# EAGLE design stepper_w_2_input_bitsA (EAGLE 6.4)
stepper conroller with 2 counting bits for unipolar stepper motor
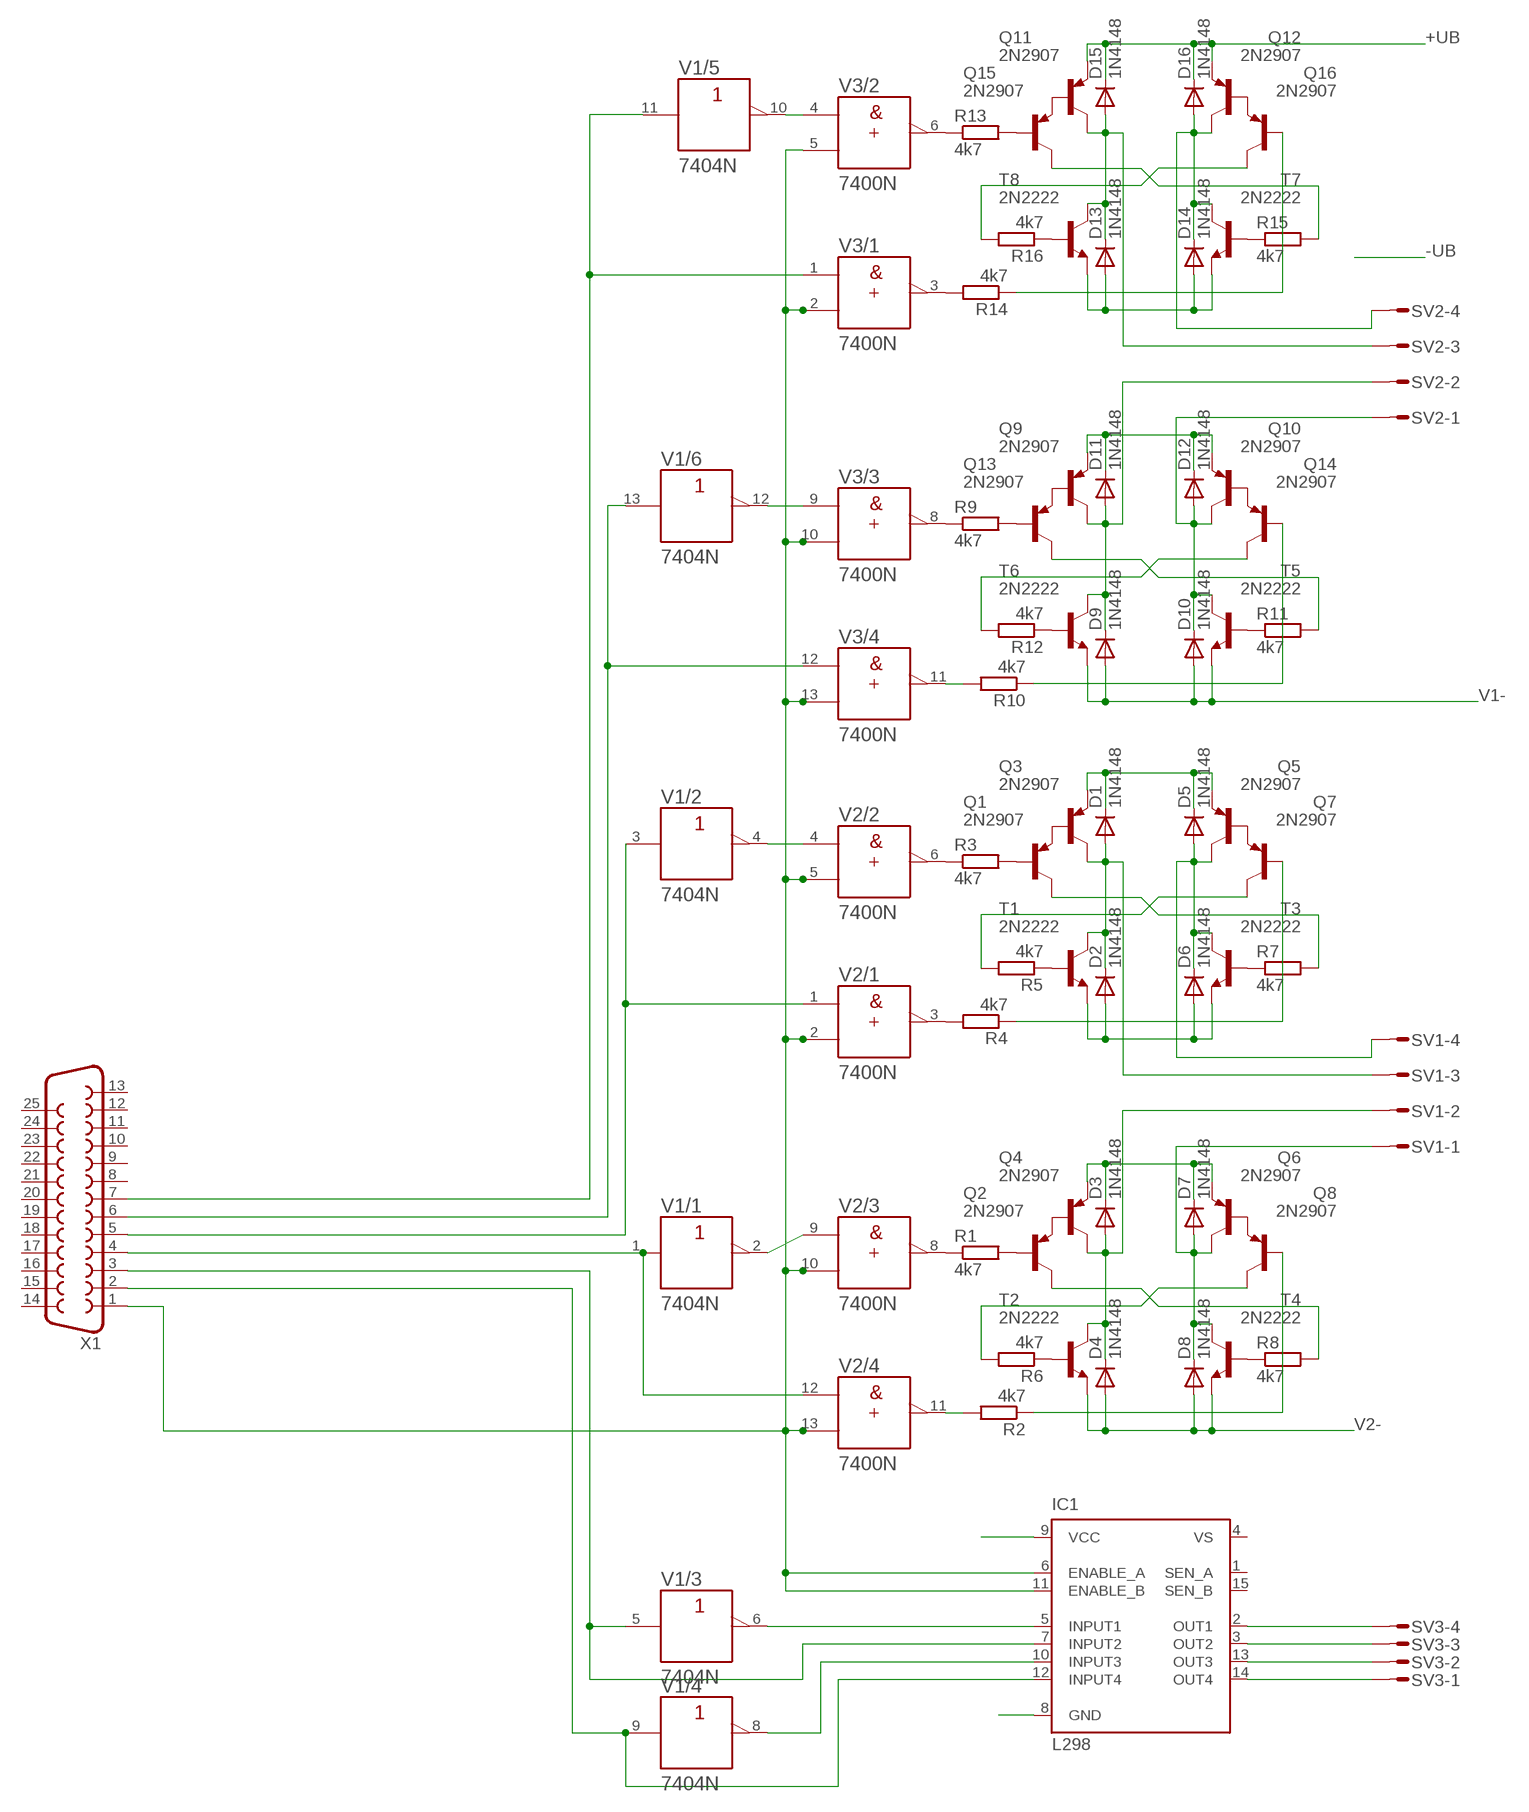
[diagram p0: schematic, sheet 1]

## Parts
D1  1N4148  DIODE-D-2.5  [D-2.5]
D2  1N4148  DIODE-D-2.5  [D-2.5]
D3  1N4148  DIODE-D-2.5  [D-2.5]
D4  1N4148  DIODE-D-2.5  [D-2.5]
D5  1N4148  DIODE-D-2.5  [D-2.5]
D6  1N4148  DIODE-D-2.5  [D-2.5]
D7  1N4148  DIODE-D-2.5  [D-2.5]
D8  1N4148  DIODE-D-2.5  [D-2.5]
D9  1N4148  DIODE-D-2.5  [D-2.5]
D10  1N4148  DIODE-D-2.5  [D-2.5]
D11  1N4148  DIODE-D-2.5  [D-2.5]
D12  1N4148  DIODE-D-2.5  [D-2.5]
D13  1N4148  DIODE-D-2.5  [D-2.5]
D14  1N4148  DIODE-D-2.5  [D-2.5]
D15  1N4148  DIODE-D-2.5  [D-2.5]
D16  1N4148  DIODE-D-2.5  [D-2.5]
IC1  L298  [MULTIWATT-15]
Q1  2N2907  [TO18]
Q2  2N2907  [TO18]
Q3  2N2907  [TO18]
Q4  2N2907  [TO18]
Q5  2N2907  [TO18]
Q6  2N2907  [TO18]
Q7  2N2907  [TO18]
Q8  2N2907  [TO18]
Q9  2N2907  [TO18]
Q10  2N2907  [TO18]
Q11  2N2907  [TO18]
Q12  2N2907  [TO18]
Q13  2N2907  [TO18]
Q14  2N2907  [TO18]
Q15  2N2907  [TO18]
Q16  2N2907  [TO18]
R1  4k7  R-EU_0204/7  [0204/7]
R2  4k7  R-EU_0207/10  [0207/10]
R3  4k7  R-EU_0207/10  [0207/10]
R4  4k7  R-EU_0207/10  [0207/10]
R5  4k7  R-EU_0207/10  [0207/10]
R6  4k7  R-EU_0207/10  [0207/10]
R7  4k7  R-EU_0207/10  [0207/10]
R8  4k7  R-EU_0207/10  [0207/10]
R9  4k7  R-EU_0204/7  [0204/7]
R10  4k7  R-EU_0207/10  [0207/10]
R11  4k7  R-EU_0207/10  [0207/10]
R12  4k7  R-EU_0207/10  [0207/10]
R13  4k7  R-EU_0207/10  [0207/10]
R14  4k7  R-EU_0207/10  [0207/10]
R15  4k7  R-EU_0207/10  [0207/10]
R16  4k7  R-EU_0207/10  [0207/10]
SV1  S04P  [S04P]
SV2  S04P  [S04P]
SV3  S04P  [S04P]
T1  2N2222  [TO18]
T2  2N2222  [TO18]
T3  2N2222  [TO18]
T4  2N2222  [TO18]
T5  2N2222  [TO18]
T6  2N2222  [TO18]
T7  2N2222  [TO18]
T8  2N2222  [TO18]
V1  7404N  [DIL14]
V2  7400N  [DIL14]
V3  7400N  [DIL14]
X1  F25HP  [F25HP]

## Nets
+UB: D1.C D3.C D5.C D7.C D11.C D12.C D15.C D16.C IC1.9(VCC) Q3.1(E) Q4.1(E) Q5.1(E) Q6.1(E) Q9.1(E) Q10.1(E) Q11.1(E) Q12.1(E)
-UB: IC1.8(GND)
N$1: R6.1 T2.2(B)
N$2: Q8.3(C) R6.2
N$3: R8.1 T4.2(B)
N$4: Q2.2(B) R1.2
N$5: Q8.2(B) R2.1
N$6: Q2.1(E) Q4.2(B)
N$7: Q2.3(C) R8.2
N$8: Q6.2(B) Q8.1(E)
N$9: D3.A D4.C Q4.3(C) SV1.2 T2.3(C)
N$10: D7.A D8.C Q6.3(C) SV1.1 T4.3(C)
N$11: R1.1 V2.8(/3:Y)
N$12: R2.2 V2.11(/4:Y)
N$13: Q7.3(C) R5.2
N$14: V1.4(/2:Y) V2.4(/2:A)
N$15: Q7.2(B) R4.1
N$16: R5.1 T1.2(B)
N$17: Q1.3(C) R7.2
N$18: R7.1 T3.2(B)
N$19: D1.A D2.C Q3.3(C) SV1.3 T1.3(C)
N$20: D5.A D6.C Q5.3(C) SV1.4 T3.3(C)
N$21: Q1.1(E) Q3.2(B)
N$22: Q5.2(B) Q7.1(E)
N$23: R4.2 V2.3(/1:Y)
N$24: R3.1 V2.6(/2:Y)
N$25: V1.3(/2:A) V2.1(/1:A) X1.5
N$26: Q1.2(B) R3.2
N$27: V1.2(/1:Y) V2.9(/3:A)
N$28: V1.1(/1:A) V2.12(/4:A) X1.4
N$29: Q14.3(C) R12.2
N$30: Q14.2(B) R10.1
N$31: Q13.3(C) R11.2
N$32: D9.C D11.A Q9.3(C) SV2.2 T6.3(C)
N$33: D10.C D12.A Q10.3(C) SV2.1 T5.3(C)
N$34: R9.1 V3.8(/3:Y)
N$35: R10.2 V3.11(/4:Y)
N$36: Q16.3(C) R16.2
N$37: Q16.2(B) R14.1
N$38: Q15.3(C) R15.2
N$39: D13.C D15.A Q11.3(C) SV2.3 T8.3(C)
N$40: D14.C D16.A Q12.3(C) SV2.4 T7.3(C)
N$41: R14.2 V3.3(/1:Y)
N$42: R13.1 V3.6(/2:Y)
N$43: R12.1 T6.2(B)
N$44: R11.1 T5.2(B)
N$45: Q9.2(B) Q13.1(E)
N$46: Q10.2(B) Q14.1(E)
N$47: R16.1 T8.2(B)
N$48: R15.1 T7.2(B)
N$49: Q11.2(B) Q15.1(E)
N$50: Q12.2(B) Q16.1(E)
N$51: Q15.2(B) R13.2
N$52: V1.10(/5:Y) V3.4(/2:A)
N$53: V1.11(/5:A) V3.1(/1:A) X1.7
N$54: IC1.2(OUT1) SV3.4
N$55: V1.13(/6:A) V3.12(/4:A) X1.6
N$56: Q13.2(B) R9.2
N$57: IC1.3(OUT2) SV3.3
N$58: IC1.13(OUT3) SV3.2
N$59: IC1.14(OUT4) SV3.1
N$79: IC1.5(INPUT1) V1.6(/3:Y)
N$80: IC1.7(INPUT2) V1.5(/3:A) X1.3
N$81: V1.12(/6:Y) V3.9(/3:A)
N$82: IC1.12(INPUT4) V1.9(/4:A) X1.2
N$85: IC1.10(INPUT3) V1.8(/4:Y)
STROBE: IC1.6(ENABLE_A) IC1.11(ENABLE_B) V2.2(/1:B) V2.5(/2:B) V2.10(/3:B) V2.13(/4:B) V3.2(/1:B) V3.5(/2:B) V3.10(/3:B) V3.13(/4:B) X1.1
V1-: D9.A D10.A D13.A D14.A T5.1(E) T6.1(E) T7.1(E) T8.1(E)
V2-: D2.A D4.A D6.A D8.A T1.1(E) T2.1(E) T3.1(E) T4.1(E)
Unconnected: IC1.1(SEN_A) IC1.15(SEN_B) X1.8 X1.9 X1.10 X1.11 X1.12 X1.13 X1.14 X1.15 X1.16 X1.17 X1.18 X1.19 X1.20 X1.21 X1.22 X1.23 X1.24 X1.25

## Power pins joined to a net without a drawn wire
+UB: V1.14(/+UB:+UB) V2.14(/+UB:+UB) V3.14(/+UB:+UB)
-UB: V1.7(/-UB:-UB) V2.7(/-UB:-UB) V3.7(/-UB:-UB)
VS: IC1.4(VS)

## Library data of the parts
D1-D16 = diode:DIODE-: DIODE
IC1 = st-microelectronics:L298: DUAL FULL-BRIDGE DRIVER; MPN: L298N; OC_FARNELL: 1589425; OC_NEWARK: 32M1527
Q1-Q16 = transistor-pnp:2N2907*: PNP Transistor
R1-R16 = rcl:R-EU_: RESISTOR, European symbol
SV1-SV3 = con-amp-mt:S04P: AMP MT CONNECTOR; OC_FARNELL: unknown; OC_NEWARK: unknown
T1-T8 = transistor:2N2222: NPN TRANSISTOR
V1 = 74ttl-din:74*04: Hex INVERTER
V2 V3 = 74ttl-din:74*00: Quad 2-input NAND gate
X1 = con-subd:F25: SUB-D; OC_FARNELL: unknown; OC_NEWARK: unknown

## Board
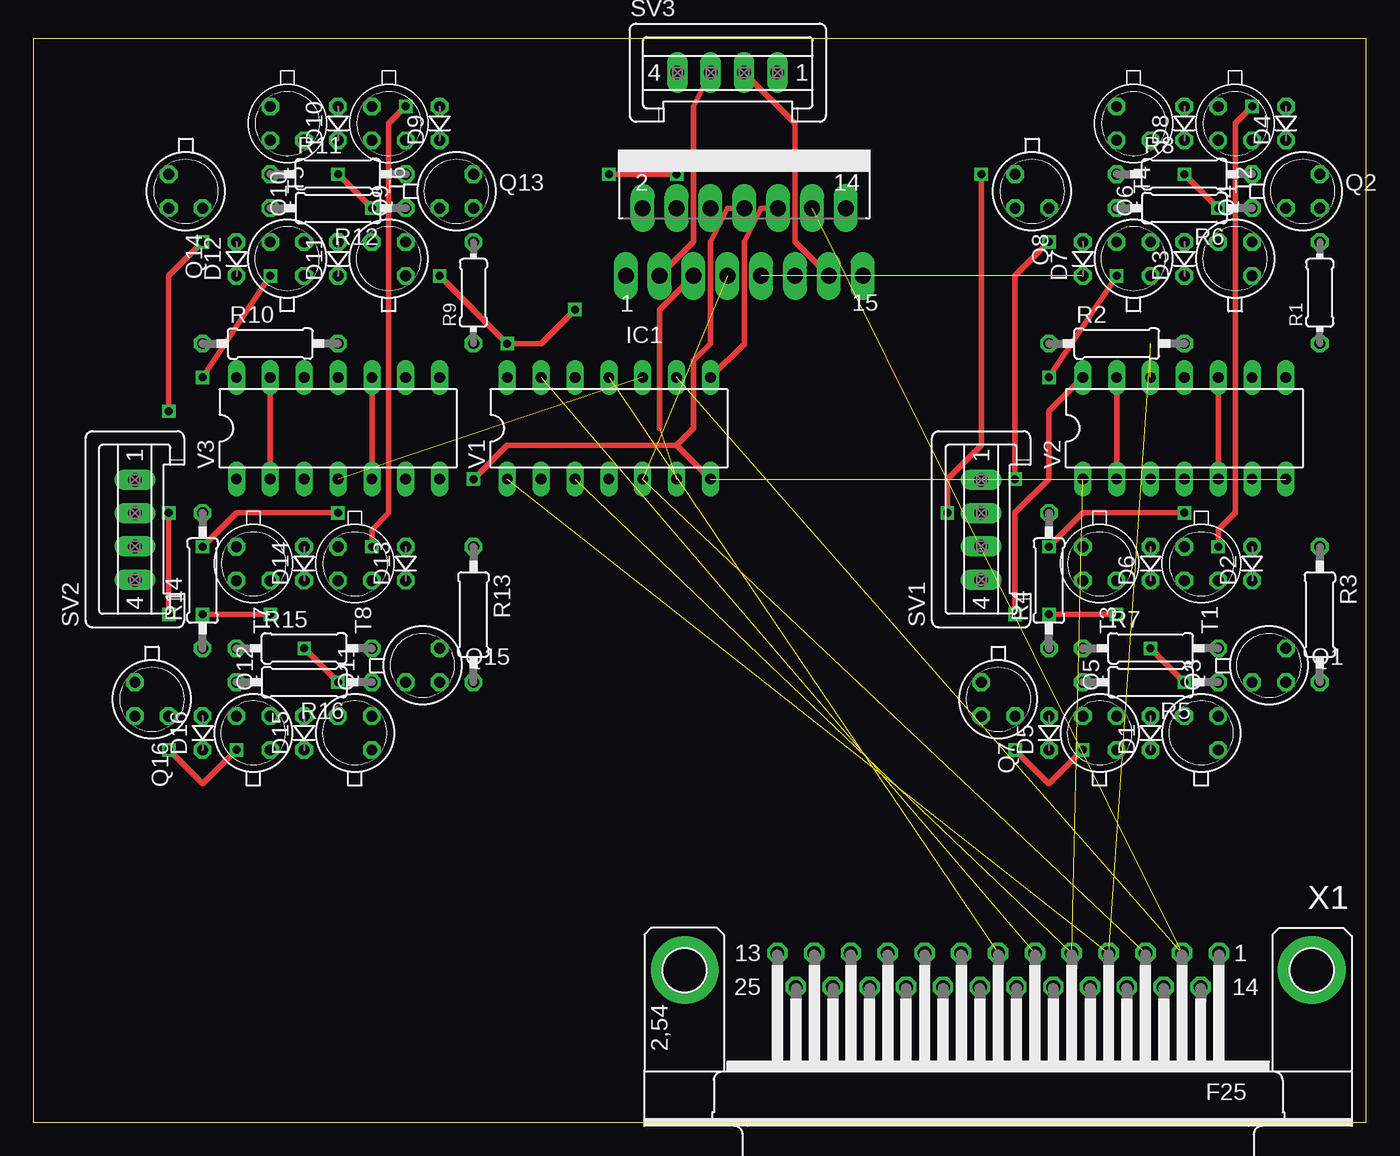
[diagram p1: board, top side]
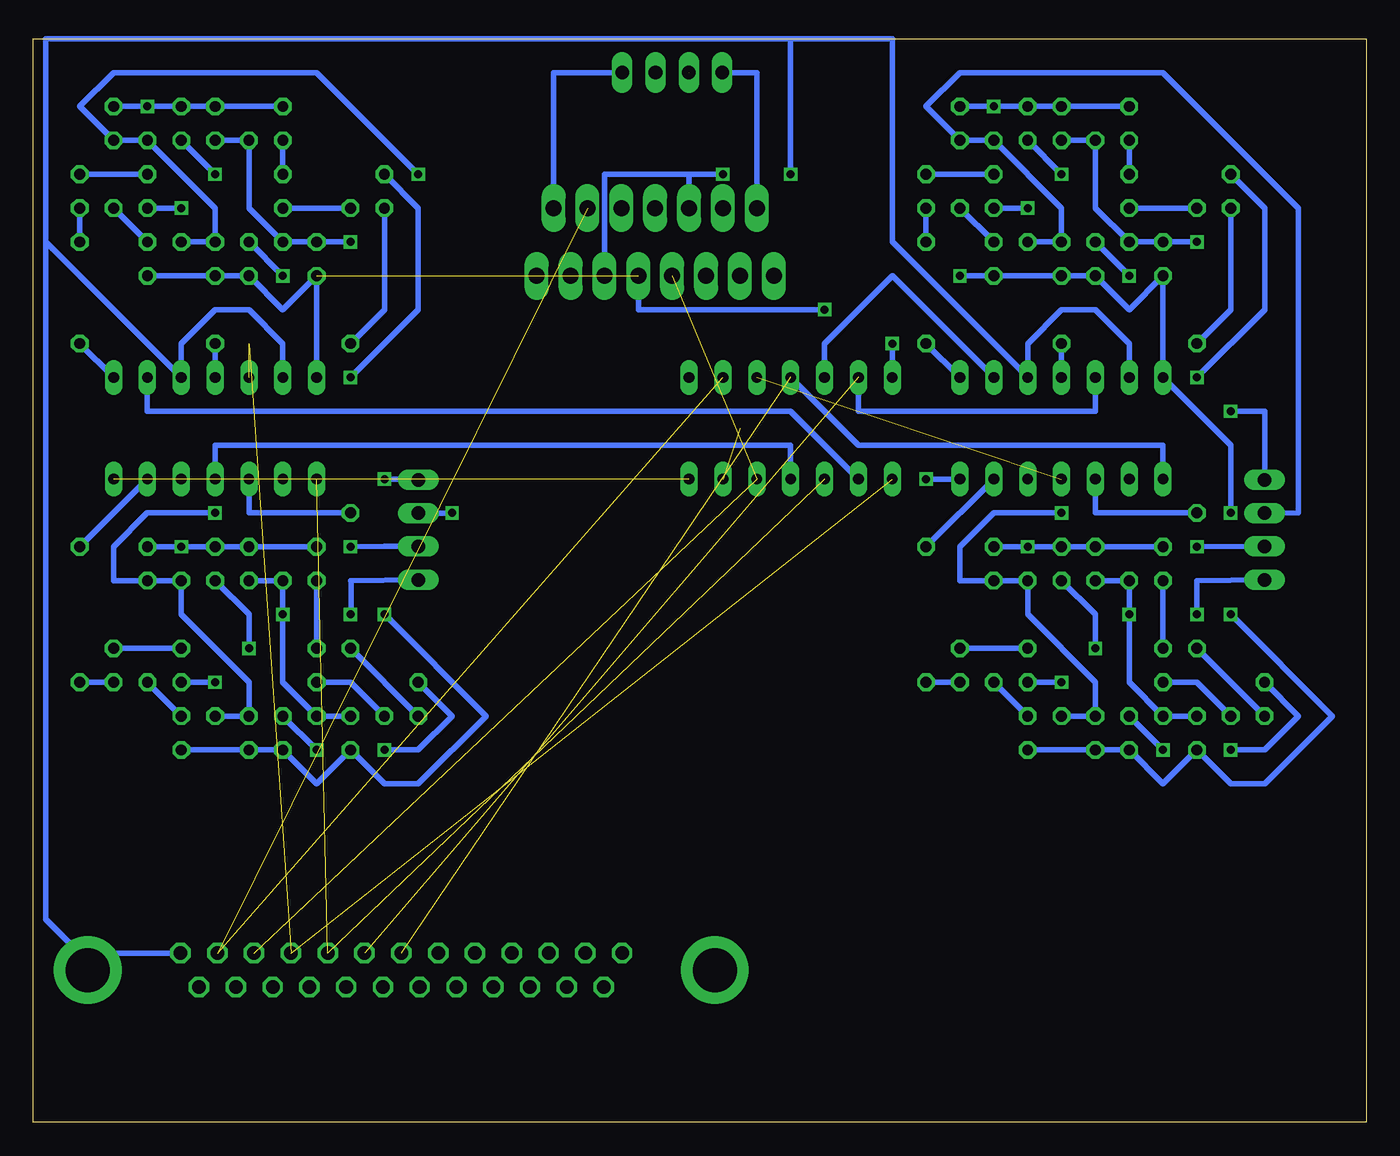
[diagram p2: board, bottom side, seen from below]

Size 100 x 81.27 mm. Coordinates in mm from the lower left corner, seen from the top.
Outline: 0,0 100,0 100,81.27 0,81.27 0,0
Copper layers (1*16): Top 0.035mm / dielectric 1.5mm / Bottom 0.035mm
Design rules "default": minimum track width 10mil, minimum drill 24mil, track to track 8mil, track to pad 8mil, pad to pad 8mil, via to via 8mil, smd to smd 8mil, copper to edge 40mil, drill to drill 8mil, minimum pad ring 10mil, minimum via ring 8mil, stop-mask expansion 4mil, vias tented up to drill 0mil, thermal gap 10mil

### Footprints (pad centres in the part's own frame; a part is rotated, then mirrored left to right if it is on the bottom)
D-2.5 = drill 0.813 octagon: A 1.27,0; C -1.27,0
MULTIWATT-15 = drill 1.2 long: 1 -8.89,-7.62; 2 -7.62,-2.54; 3 -6.35,-7.62; 4 -5.08,-2.54; 5 -3.81,-7.62; 6 -2.54,-2.54; 7 -1.27,-7.62; 8 0,-2.54; 9 1.27,-7.62; 10 2.54,-2.54; 11 3.81,-7.62; 12 5.08,-2.54; 13 6.35,-7.62; 14 7.62,-2.54; 15 8.89,-7.62
TO18 = drill 0.813 octagon: 1 -1.27,-1.27; 2 1.27,-1.27; 3 1.27,1.27
0204/7 = drill 0.813 octagon: 1 -3.81,0; 2 3.81,0
0207/10 = drill 0.813 octagon: 1 -5.08,0; 2 5.08,0
S04P = drill 1.016 long: 1 3.75,0; 2 1.25,0; 3 -1.25,0; 4 -3.75,0
DIL14 = drill 0.813 long: 1 -7.62,-3.81; 2 -5.08,-3.81; 3 -2.54,-3.81; 4 0,-3.81; 5 2.54,-3.81; 6 5.08,-3.81; 7 7.62,-3.81; 8 7.62,3.81; 9 5.08,3.81; 10 2.54,3.81; 11 0,3.81; 12 -2.54,3.81; 13 -5.08,3.81; 14 -7.62,3.81
F25HP = drill 1.016 octagon: 1 -16.561,-1.27; 2 -13.792,-1.27; 3 -11.049,-1.27; 4 -8.28,-1.27; 5 -5.512,-1.27; 6 -2.769,-1.27; 7 0,-1.27; 8 2.769,-1.27; 9 5.512,-1.27; 10 8.28,-1.27; 11 11.049,-1.27; 12 13.792,-1.27; 13 16.561,-1.27; 14 -15.189,1.27; 15 -12.421,1.27; 16 -9.652,1.27; 17 -6.909,1.27; 18 -4.14,1.27; 19 -1.372,1.27; 20 1.372,1.27; 21 4.14,1.27; 22 6.909,1.27; 23 9.652,1.27; 24 12.421,1.27; 25 15.189,1.27 | drill 3.302 pad 5.08: G1 -23.52,0; G2 23.52,0

### Placement (x,y rotation side)
D1  83.82,29.21 90 top
D2  91.44,41.91 90 top
D3  86.36,64.77 90 top
D4  93.98,74.93 90 top
D5  76.2,29.21 90 top
D6  83.82,41.91 90 top
D7  78.74,64.77 90 top
D8  86.36,74.93 90 top
D9  30.48,74.93 90 top
D10  22.86,74.93 90 top
D11  22.86,64.77 90 top
D12  15.24,64.77 90 top
D13  27.94,41.91 90 top
D14  20.32,41.91 90 top
D15  20.32,29.21 90 top
D16  12.7,29.21 90 top
IC1  53.34,71.12 0 top
Q1  92.71,34.29 0 top
Q2  95.25,69.85 0 top
Q3  87.63,29.21 90 top
Q4  90.17,64.77 90 top
Q5  80.01,29.21 90 top
Q6  82.55,64.77 90 top
Q7  72.39,31.75 270 top
Q8  74.93,69.85 270 top
Q9  26.67,64.77 90 top
Q10  19.05,64.77 90 top
Q11  24.13,29.21 90 top
Q12  16.51,29.21 90 top
Q13  31.75,69.85 0 top
Q14  11.43,69.85 270 top
Q15  29.21,34.29 0 top
Q16  8.89,31.75 270 top
R1  96.52,62.23 90 top
R2  81.28,58.42 0 top
R3  96.52,38.1 270 top
R4  76.2,40.64 90 top
R5  83.82,33.02 180 top
R6  86.36,68.58 180 top
R7  83.82,35.56 0 top
R8  86.36,71.12 0 top
R9  33.02,62.23 90 top
R10  17.78,58.42 0 top
R11  22.86,71.12 0 top
R12  22.86,68.58 180 top
R13  33.02,38.1 270 top
R14  12.7,40.64 90 top
R15  20.32,35.56 0 top
R16  20.32,33.02 180 top
SV1  71.12,44.45 90 top
SV2  7.62,44.45 90 top
SV3  52.07,78.74 0 top
T1  87.63,41.91 270 top
T2  90.17,74.93 270 top
T3  80.01,41.91 270 top
T4  82.55,74.93 270 top
T5  19.05,74.93 270 top
T6  26.67,74.93 270 top
T7  16.51,41.91 270 top
T8  24.13,41.91 270 top
V1  43.18,52.07 0 top
V2  86.36,52.07 0 top
V3  22.86,52.07 0 top
X1  72.39,11.43 180 top

### Tracks (layer width: path | path; a pad name or v marks a point on that pad's centre or on a via)
+UB  (via drill 0.6)  (1 unrouted)
  Top 0.406: v10.16,38.1 v10.16,45.72 | v30.48,63.5 v35.56,58.42 38.1,58.42 v40.64,60.96 | v73.66,38.1 73.66,45.72 76.2,48.26 76.2,53.34 V2.14
  Bottom 0.406: D1.C Q3.1 Q5.1 78.74,25.4 D5.C 73.66,25.4 71.12,25.4 66.04,30.48 v73.66,38.1 | Q4.1 D3.C Q6.1 81.28,60.96 D7.C V2.14 | Q11.1 D15.C Q12.1 15.24,25.4 D16.C 10.16,25.4 7.62,25.4 2.54,30.48 v10.16,38.1 | v10.16,45.72 10.16,50.8 V3.14 D12.C 17.78,60.96 Q10.1 D11.C Q9.1 v30.48,63.5 | V1.14 v35.56,58.42 | IC1.9 54.61,60.96 v40.64,60.96
-UB  (via drill 0.6)  (1 unrouted)
  Top 0.406: v33.02,48.26 35.56,50.8 48.26,50.8 | V1.7 48.26,50.8 | IC1.8 52.07,68.58 50.8,66.04 50.8,58.42 49.53,57.15 49.53,52.07 48.26,50.8
  Bottom 0.406: V3.7 v33.02,48.26
N$1  (via drill 0.6)
  Top 0.406: v88.9,68.58 v86.36,71.12
  Bottom 0.406: R6.1 v88.9,68.58 | v86.36,71.12 T2.2
N$2
  Bottom 0.406: Q8.3 R6.2
N$3
  Bottom 0.406: R8.1 T4.2
N$4
  Bottom 0.406: R1.2 Q2.2
N$5
  Bottom 0.406: Q8.2 73.66,60.96 R2.1
N$6
  Bottom 0.406: Q4.2 Q2.1
N$7
  Bottom 0.406: Q2.3 R8.2
N$8  (via drill 0.6)
  Top 0.406: v81.28,63.5 v76.2,55.88
  Bottom 0.406: v76.2,55.88 71.12,60.96 71.12,68.58 Q8.1 | Q6.2 v81.28,63.5
N$9  (via drill 0.6)
  Top 0.406: v68.58,45.72 68.58,48.26 71.12,50.8 v71.12,71.12
  Bottom 0.406: Q4.3 D3.A 86.36,68.58 T2.3 D4.C 96.52,76.2 93.98,78.74 78.74,78.74 v71.12,71.12 | SV1.2 68.6,45.7 v68.58,45.72
N$10  (via drill 0.6)
  Top 0.406: v76.2,66.04 73.66,63.5 v73.66,48.26
  Bottom 0.406: D8.C T4.3 83.82,68.58 Q6.3 D7.A v76.2,66.04 | v73.66,48.26 71.12,48.26 SV1.1
N$11
  Bottom 0.406: R1.1 V2.8
N$12
  Bottom 0.406: V2.11 R2.2
N$13
  Bottom 0.406: Q7.3 76.2,33.02 R5.2
N$14
  Bottom 0.406: V2.4 86.36,50.8 43.18,50.8 V1.4
N$15
  Bottom 0.406: R4.1 Q7.2
N$16  (via drill 0.6)
  Top 0.406: v86.36,33.02 v83.82,35.56
  Bottom 0.406: R5.1 v86.36,33.02 | v83.82,35.56 83.82,38.1 T1.2
N$17
  Bottom 0.406: Q1.3 R7.2
N$18
  Bottom 0.406: R7.1 T3.2
N$19  (via drill 0.6)
  Top 0.406: v76.2,43.18 78.74,45.72 v86.36,45.72
  Bottom 0.406: Q3.3 D1.A 83.82,33.02 88.9,38.1 T1.3 D2.C 93.98,40.64 93.98,43.18 91.44,45.72 v86.36,45.72 | SV1.3 73.64,43.2 v76.2,43.18
N$20  (via drill 0.6)
  Top 0.406: v76.2,38.1 v81.28,38.1
  Bottom 0.406: D5.A Q5.3 81.28,33.02 v81.28,38.1 T3.3 D6.C | SV1.4 76.2,40.64 76.14,40.58 76.14,38.16 v76.2,38.1
N$21
  Bottom 0.406: Q3.2 Q1.1
N$22  (via drill 0.6)
  Top 0.406: v78.74,27.94 76.2,25.4 v73.66,27.94
  Bottom 0.406: Q5.2 v78.74,27.94 | Q7.1 68.58,30.48 71.12,27.94 v73.66,27.94
N$23
  Bottom 0.406: R4.2 83.82,45.72 V2.3
N$24
  Bottom 0.406: R3.1 V2.6
N$25  (2 unrouted)
N$26
  Bottom 0.406: R3.2 Q1.2
N$27
  Bottom 0.406: V2.9 91.44,53.34 43.18,53.34 V1.2
N$28  (3 unrouted)
N$29
  Bottom 0.406: Q14.3 R12.2
N$30
  Bottom 0.406: Q14.2 10.16,60.96 R10.1
N$31
  Bottom 0.406: Q13.3 R11.2
N$32
  Bottom 0.406: Q9.3 D11.A 22.86,68.58 T6.3 D9.C 33.02,76.2 30.48,78.74 15.24,78.74 5.08,68.58 5.08,45.72 SV2.2
N$33  (via drill 0.6)
  Top 0.406: v10.16,53.34 10.16,63.5 v12.7,66.04
  Bottom 0.406: D10.C T5.3 20.32,68.58 Q10.3 D12.A v12.7,66.04 | SV2.1 7.62,53.34 v10.16,53.34
N$34
  Bottom 0.406: R9.1 V3.8
N$35
  Bottom 0.406: R10.2 V3.11
N$36
  Bottom 0.406: Q16.3 12.7,33.02 R16.2
N$37
  Bottom 0.406: Q16.2 R14.1
N$38
  Bottom 0.406: R15.2 Q15.3
N$39  (via drill 0.6)
  Top 0.406: v12.7,43.18 15.24,45.72 v22.86,45.72
  Bottom 0.406: Q11.3 D15.A 20.32,33.02 25.4,38.1 T8.3 D13.C 30.48,40.64 30.48,43.18 27.94,45.72 v22.86,45.72 | SV2.3 v12.7,43.18
N$40  (via drill 0.6)
  Top 0.406: v12.7,38.1 v17.78,38.1
  Bottom 0.406: D16.A Q12.3 17.78,33.02 v17.78,38.1 T7.3 D14.C | SV2.4 12.7,40.64 v12.7,38.1
N$41
  Bottom 0.406: R14.2 20.32,45.72 V3.3
N$42
  Bottom 0.406: R13.1 V3.6
N$43  (via drill 0.6)
  Top 0.406: v22.86,71.12 v25.4,68.58
  Bottom 0.406: T6.2 v22.86,71.12 | v25.4,68.58 R12.1
N$44
  Bottom 0.406: R11.1 T5.2
N$45
  Bottom 0.406: Q13.1 Q9.2
N$46  (via drill 0.6)
  Top 0.406: v12.7,55.88 v17.78,63.5
  Bottom 0.406: Q14.1 7.62,68.58 7.62,60.96 v12.7,55.88 | v17.78,63.5 Q10.2
N$47  (via drill 0.6)
  Top 0.406: v20.32,35.56 v22.86,33.02
  Bottom 0.406: T8.2 20.32,38.1 v20.32,35.56 | v22.86,33.02 R16.1
N$48
  Bottom 0.406: R15.1 T7.2
N$49
  Bottom 0.406: Q11.2 Q15.1
N$50  (via drill 0.6)
  Top 0.406: v10.16,27.94 12.7,25.4 v15.24,27.94
  Bottom 0.406: Q16.1 5.08,30.48 7.62,27.94 v10.16,27.94 | v15.24,27.94 Q12.2
N$51
  Bottom 0.406: Q15.2 R13.2
N$52  (1 unrouted)
N$53  (1 unrouted)
  Bottom 0.406: V3.1 15.24,50.8 38.1,50.8 V1.11
N$54
  Bottom 0.406: SV3.4 45.72,78.74 IC1.2
N$55  (1 unrouted)
  Bottom 0.406: V3.12 20.32,53.34 38.1,53.34 V1.13
N$56
  Bottom 0.406: Q13.2 R9.2
N$57  (1 unrouted)
  Top 0.406: IC1.3 49.53,66.04 49.53,76.2 50.8,78.74
N$58
  Top 0.406: IC1.13 57.15,66.04 57.15,74.93 SV3.2
N$59
  Bottom 0.406: SV3.1 60.96,78.74 IC1.14
N$79  (1 unrouted)
  Top 0.406: IC1.5 46.99,60.96 46.99,52.07
N$80  (2 unrouted)
N$81
  Bottom 0.406: V3.9 35.56,63.5 40.64,58.42 V1.12
N$82  (2 unrouted)
N$85
  Top 0.406: IC1.10 54.61,68.58 53.34,66.04 53.34,58.42 V1.8
STROBE  (via drill 0.6)
  Top 0.406: V3.5 V3.10 | V3.2 V3.13 | V2.10 V2.5 | V2.2 V2.13 | v48.26,71.12 v43.18,71.12
  Bottom 0.406: 43.18,81.28 35.56,81.28 35.56,66.04 V3.10 25.4,58.42 22.86,60.96 20.32,60.96 17.78,58.42 V3.13 | 43.18,81.28 99.06,81.28 99.06,66.04 | 99.06,66.04 V2.10 88.9,58.42 86.36,60.96 83.82,60.96 81.28,58.42 V2.13 | X1.1 96.52,12.7 99.06,15.24 99.06,66.04 | v43.18,71.12 43.18,81.28 | IC1.6 50.8,71.12 v48.26,71.12 57.15,71.12 IC1.11
V1-  (via drill 0.6)
  Top 0.406: v25.4,43.18 25.4,44.45 26.67,45.72 26.67,74.93 v27.94,76.2
  Bottom 0.406: T5.1 D10.A T6.1 v27.94,76.2 D9.A | D13.A v25.4,43.18 T8.1 D14.A T7.1
V2-  (via drill 0.6)
  Top 0.406: v88.9,43.18 88.9,44.45 90.17,45.72 90.17,74.93 v91.44,76.2
  Bottom 0.406: D4.A v91.44,76.2 T2.1 D8.A T4.1 | T3.1 D6.A T1.1 v88.9,43.18 D2.A